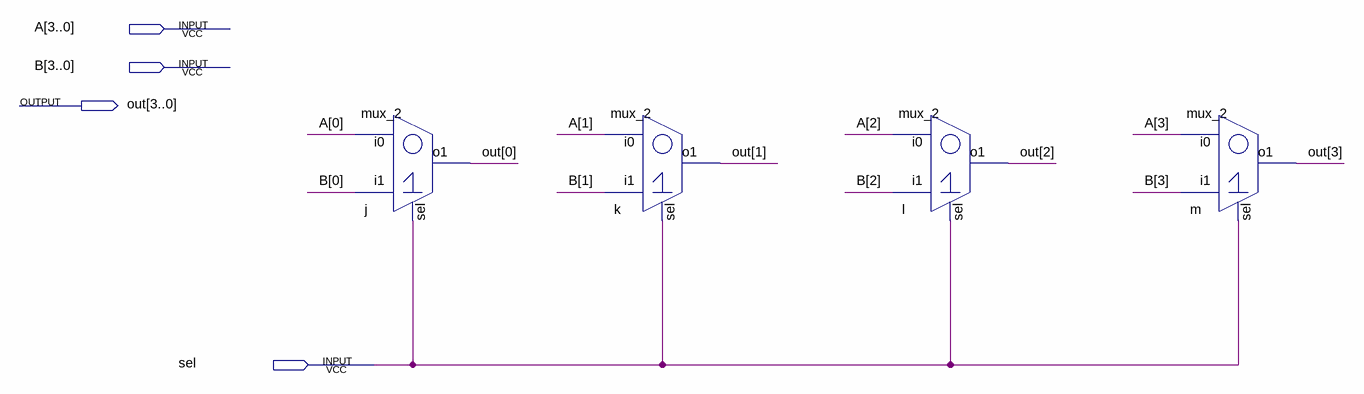
[diagram p0: schematic sheet]
// Quartus schematic MUX4.bdf as structural Verilog: 4 symbols, 4 pins
module MUX4 (
  input  [3:0] A,
  input  [3:0] B,
  input  sel,
  output [3:0] out
);

  mux_2 j (.sel(sel), .i0(A[0]), .i1(B[0]), .o1(out[0]));
  mux_2 k (.sel(sel), .i0(A[1]), .i1(B[1]), .o1(out[1]));
  mux_2 l (.sel(sel), .i0(A[2]), .i1(B[2]), .o1(out[2]));
  mux_2 m (.sel(sel), .i0(A[3]), .i1(B[3]), .o1(out[3]));
endmodule
